# Altium project NUC980开发板.PrjPcb
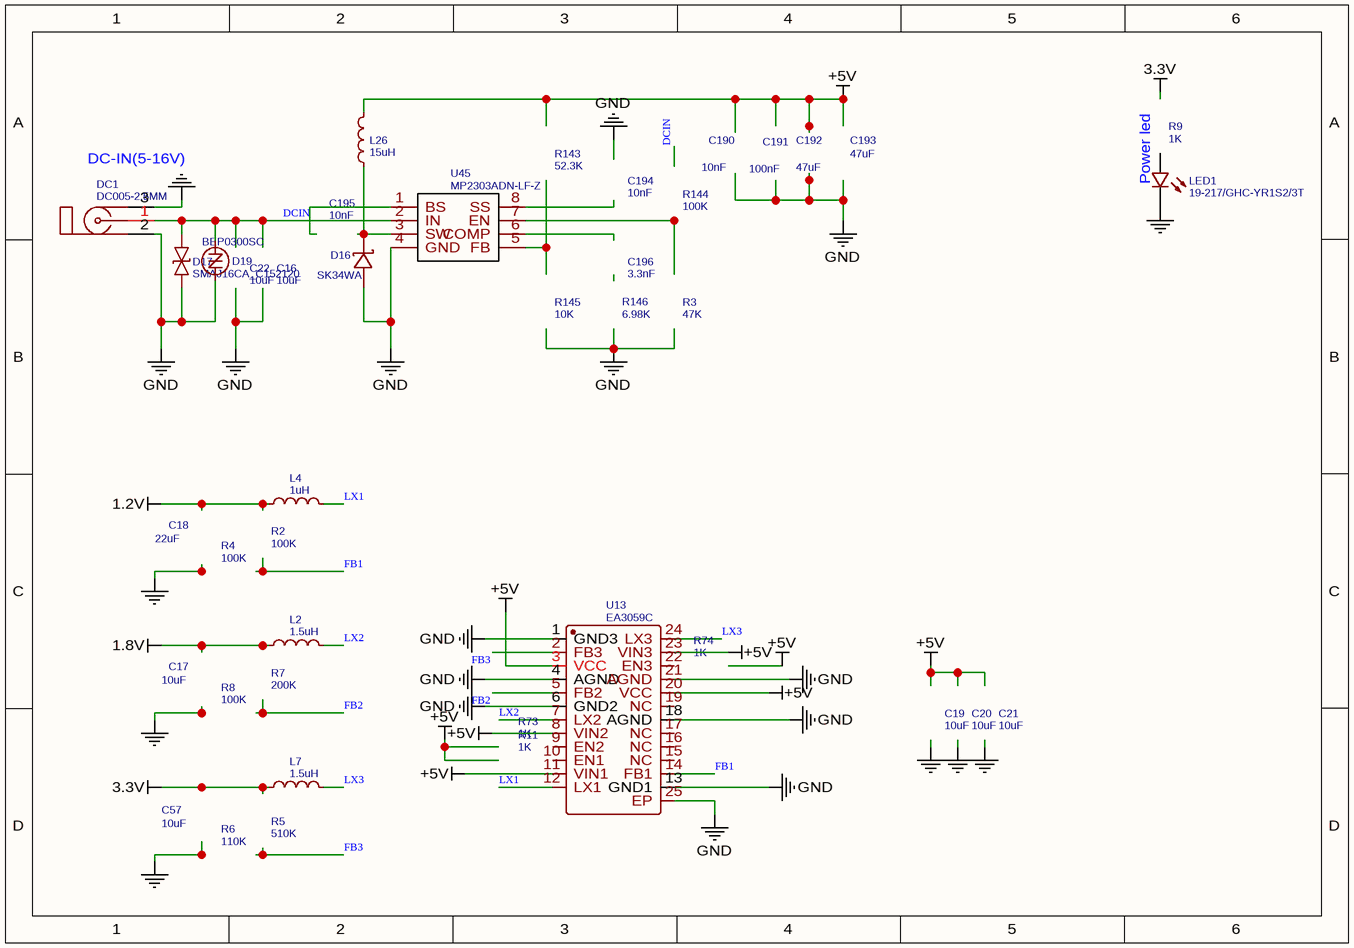
[diagram p0: 电源单元.schdoc]
4 sheets, 128 parts. Net scope: global (net labels, ports and power ports of the same name join across sheets).
Board file: 矩形板V6.0(可制造).pcbdoc
Sheets:
  电源单元.schdoc
  主控单元.schdoc
  接口单元.schdoc
  存储单元.schdoc

## Sheet 电源单元.schdoc
size 252 x 176 mm

### Parts
C16  10uF  [1206]
C17  10uF  [0603]
C18  22uF  [0603]
C19  10uF  [0603]
C20  10uF  [0603]
C21  10uF  [0603]
C22  10uF  [1206]
C57  10uF  [0603]
C190  10nF  [0603]
C191  100nF  [0603]
C192  47uF  [1210]
C193  47uF  [1210]
C194  10nF  [0603]
C195  10nF  [0603]
C196  3.3nF  [0603]
D16  SK34WA  [SOD-123F]
D17  SMAJ16CA_C152120  [SMA(DO-214AC)-DOB]
D19  BEP0300SC  [SMB(DO-214AA)]
DC1  DC005-2.5MM  [DC-5020]
L2  1.5uH  [L-SMD-4.1X4.6]
L4  1uH  [L-SMD-4.1X4.6]
L7  1.5uH  [L-SMD-4.1X4.6]
L26  15uH  [SMD-L-7.1X6.6]
LED1  19-217/GHC-YR1S2/3T  [LED-0603]
R2  100K  [0603]
R3  47K  [0603]
R4  100K  [0603]
R5  510K  [0603]
R6  110K  [0603]
R7  200K  [0603]
R8  100K  [0603]
R9  1K  [0603]
R11  1K  [0603]
R73  1K  [0603]
R74  1K  [0603]
R143  52.3K  [0603]
R144  100K  [0603]
R145  10K  [0603]
R146  6.98K  [0603]
U13  EA3059C  [QFN-24_4X4X05P]
U45  MP2303ADN-LF-Z  [SOIC-8_EP_150MIL]

### Nets
1.2V: L4.1
1.8V: L2.1
3.3V: L7.1
+5V: L26.2 U13.3(VCC) U13.8(VIN2) U13.11(VIN1) U13.20(VCC) U13.23(VIN3)
GND: D16.1(A) D17.1(K) D19.1 DC1.2 DC1.3 LED1.2(C) U13.1(GND3) U13.4(AGND) U13.6(GND2) U13.13(GND1) U13.18(AGND) U13.21(AGND) U13.25(EP) U45.4(GND)
DCIN: D17.2(A) D19.2 DC1.1(VCC) U45.2(IN)
FB1: U13.14(FB1)
FB2: U13.5(FB2)
FB3: U13.2(FB3)
LX1: L4.2 U13.12(LX1)
LX2: L2.2 U13.7(LX2)
LX3: L7.2 U13.24(LX3)
NetD16_2: D16.2(K) L26.1 U45.3(SW)

Not connected (* = marked no-connect by the designer): LED1 1(A); U13 9(EN2) 10(EN1) 15(NC) 16(NC) 17(NC) 19(NC) 22(EN3); U45 1(BS) 5(FB) 6(COMP) 7(EN) 8(SS)

### Notes on the sheet
- (near DC1) DC-IN(5-16V)
- Power led

### Library data of the parts
C16 C22 = 10uF: BOM_Manufacturer Part: CL31A106KBHNNNE; BOM_Manufacturer: SAMSUNG; nameAlias: Capacitance; SMT Type: Basic; BOM_Supplier: LCSC; BOM_LCSC Assembly: Yes; BOM_Supplier Part: C13585; spicePre: C; spiceSymbolName: CL31A106KBHNNNE
C17 C19-C21 C57 = 10uF: BOM_Manufacturer: SAMSUNG; BOM_Manufacturer Part: CL10A106KP8NNNC; nameAlias: Capacitance; BOM_Supplier: LCSC; BOM_LCSC Assembly: Yes; BOM_Supplier Part: C19702; spicePre: C; spiceSymbolName: CL10A106KP8NNNC
C18 = 22uF: BOM_Manufacturer: SAMSUNG; BOM_Manufacturer Part: CL10A226MQ8NRNC; nameAlias: Capacitance; BOM_Supplier: LCSC; BOM_LCSC Assembly: Yes; BOM_Supplier Part: C59461; spicePre: C; spiceSymbolName: CL10A226MQ8NRNC
C190 C194 C195 = 10nF: BOM_Manufacturer: FH; BOM_Manufacturer Part: 0603B103K500NT; nameAlias: Capacitance; SMT Type: Basic; BOM_Supplier: LCSC; BOM_LCSC Assembly: Yes; BOM_Supplier Part: C57112; spicePre: C; spiceSymbolName: 0603B103K500NT
C191 = 100nF: BOM_Manufacturer: YAGEO; BOM_Manufacturer Part: CC0603KRX7R9BB104; nameAlias: Capacitance; SMT Type: Basic; BOM_Supplier: LCSC; BOM_LCSC Assembly: Yes; BOM_Supplier Part: C14663; spicePre: C; spiceSymbolName: CC0603KRX7R9BB104
C192 C193 = 47uF: BOM_Manufacturer: Murata Electronics; BOM_Manufacturer Part: GRM32EC81C476KE15L; nameAlias: Capacitance; Contributor: LCSC; BOM_Supplier: LCSC; BOM_Supplier Part: C162512; spicePre: C; spiceSymbolName: GRM32EC81C476KE15L
C196 = 3.3nF: BOM_Manufacturer Part: CL10B332KB8NNNC; BOM_Manufacturer: SAMSUNG; nameAlias: Capacitance; SMT Type: Basic; BOM_Supplier: LCSC; BOM_LCSC Assembly: Yes; BOM_Supplier Part: C1613; spicePre: C; spiceSymbolName: CL10B332KB8NNNC
D16 = SK34WA: BOM_Manufacturer: SK; SMT Type: Extend; BOM_Supplier: LCSC; BOM_Manufacturer Part: SK34WA; BOM_Supplier Part: C122863; BOM_LCSC Assembly: Yes; spicePre: D
D17 = SMAJ16CA_C152120: BOM_Manufacturer: Bourne Semicon (Shenzhen); Contributor: LCSC; SMT Type: Extend; BOM_Supplier: LCSC; BOM_Supplier Part: C152120; BOM_Manufacturer Part: SMAJ16CA; BOM_LCSC Assembly: Yes; spicePre: D
D19 = BEP0300SC: BOM_Manufacturer: Bourne Semicon (Shenzhen); Contributor: LCSC; SMT Type: Extend; BOM_Supplier: LCSC; BOM_Supplier Part: C152140; BOM_Manufacturer Part: BEP0300SC; BOM_LCSC Assembly: Yes; spicePre: D
DC1 = DC005-2.5MM: BOM_Manufacturer: SOFNG; BOM_Supplier: LCSC; BOM_Manufacturer Part: DC005-2.5MM; BOM_Supplier Part: C111573; spicePre: D
L2 L7 = 1.5uH: BOM_Manufacturer: Chilisin Elec; BOM_Manufacturer Part: MHCI04020-1R5M-R8; nameAlias: Inductance; Contributor: LCSC; BOM_Supplier: LCSC; BOM_Supplier Part: C285743; spicePre: L; spiceSymbolName: MHCI04020-1R5M-R8
L4 = 1uH: BOM_Manufacturer: Chilisin Elec; BOM_Manufacturer Part: MHCI04012-1R0M-R8; nameAlias: Inductance; Contributor: LCSC; BOM_Supplier: LCSC; BOM_Supplier Part: C285749; spicePre: L; spiceSymbolName: MHCI04012-1R0M-R8
L26 = 15uH: BOM_Manufacturer: Sunlord; BOM_Manufacturer Part: MWSA0603-150MT; nameAlias: Inductance; Contributor: LCSC; BOM_Supplier: LCSC; BOM_Supplier Part: C132136; spicePre: L; spiceSymbolName: MWSA0603-150MT
LED1 = 19-217/GHC-YR1S2/3T: BOM_Manufacturer: EVERLIGHT; SMT Type: Basic; BOM_Supplier: LCSC; BOM_Manufacturer Part: 19-217/GHC-YR1S2/3T; BOM_LCSC Assembly: Yes; image: //image.lceda.cn/szlcsc/C72043.jpg; BOM_Supplier Part: C72043; spicePre: L
R2 R4 R8 R144 = 100K: BOM_Manufacturer: UniOhm; BOM_Manufacturer Part: 0603WAF1003T5E; nameAlias: Resistance (Ohms); SMT Type: Basic; BOM_Supplier: LCSC; BOM_LCSC Assembly: Yes; BOM_Supplier Part: C25803; spicePre: R; spiceSymbolName: 0603WAF1003T5E
R3 = 47K: BOM_Manufacturer: UniOhm; BOM_Manufacturer Part: 0603WAF4702T5E; nameAlias: Resistance (Ohms); SMT Type: Basic; BOM_Supplier: LCSC; BOM_LCSC Assembly: Yes; BOM_Supplier Part: C25819; spicePre: R; spiceSymbolName: 0603WAF4702T5E
R5 = 510K: BOM_Manufacturer: UniOhm; BOM_Manufacturer Part: 0603WAF5103T5E; nameAlias: Resistance (Ohms); SMT Type: Basic; BOM_Supplier: LCSC; BOM_LCSC Assembly: Yes; BOM_Supplier Part: C23192; spicePre: R; spiceSymbolName: 0603WAF5103T5E
R6 = 110K: BOM_Manufacturer: UniOhm; BOM_Manufacturer Part: 0603WAF1103T5E; nameAlias: Resistance (Ohms); SMT Type: Basic; BOM_Supplier: LCSC; BOM_LCSC Assembly: Yes; BOM_Supplier Part: C25805; spicePre: R; spiceSymbolName: 0603WAF1103T5E
R7 = 200K: BOM_Manufacturer: UniOhm; BOM_Manufacturer Part: 0603WAF2003T5E; nameAlias: Resistance (Ohms); SMT Type: Basic; BOM_Supplier: LCSC; BOM_LCSC Assembly: Yes; BOM_Supplier Part: C25811; spicePre: R; spiceSymbolName: 0603WAF2003T5E
R9 R11 R73 R74 = 1K: BOM_Manufacturer: UniOhm; BOM_Manufacturer Part: 0603WAF1001T5E; nameAlias: Resistance (Ohms); SMT Type: Basic; BOM_Supplier: LCSC; BOM_LCSC Assembly: Yes; BOM_Supplier Part: C21190; spicePre: R; spiceSymbolName: 0603WAF1001T5E
R143 = 52.3K: BOM_Manufacturer: UniOhm; BOM_Manufacturer Part: 0603WAF5232T5E; nameAlias: Resistance (Ohms); SMT Type: Extend; BOM_Supplier: LCSC; BOM_Supplier Part: C23198; BOM_LCSC Assembly: Yes; spicePre: R; spiceSymbolName: 0603WAF5232T5E
R145 = 10K: BOM_Manufacturer: UniOhm; BOM_Manufacturer Part: 0603WAF1002T5E; nameAlias: Resistance (Ohms); SMT Type: Basic; BOM_Supplier: LCSC; BOM_LCSC Assembly: Yes; BOM_Supplier Part: C25804; spicePre: R; spiceSymbolName: 0603WAF1002T5E
R146 = 6.98K: BOM_Manufacturer: UniOhm; BOM_Manufacturer Part: 0603WAF6981T5E; nameAlias: Resistance (Ohms); SMT Type: Extend; BOM_Supplier: LCSC; BOM_Supplier Part: C23215; BOM_LCSC Assembly: Yes; spicePre: R; spiceSymbolName: 0603WAF6981T5E
U13 = EA3059C: BOM_Manufacturer: Everanalog; BOM_Manufacturer Part: EA3059; SMT Type: Extend; Contributor: 13603072355; BOM_Supplier: LCSC; BOM_Supplier Part: C111586x; BOM_LCSC Assembly: Yes; spicePre: U
U45 = MP2303ADN-LF-Z: BOM_Manufacturer: MPS; SMT Type: Basic; BOM_Supplier: LCSC; BOM_Manufacturer Part: MP2303ADN-LF-Z; BOM_LCSC Assembly: Yes; image: //image.lceda.cn/szlcsc/C18876.jpg; BOM_Supplier Part: C18876; spicePre: U

## Sheet 主控单元.schdoc
size 418 x 270 mm
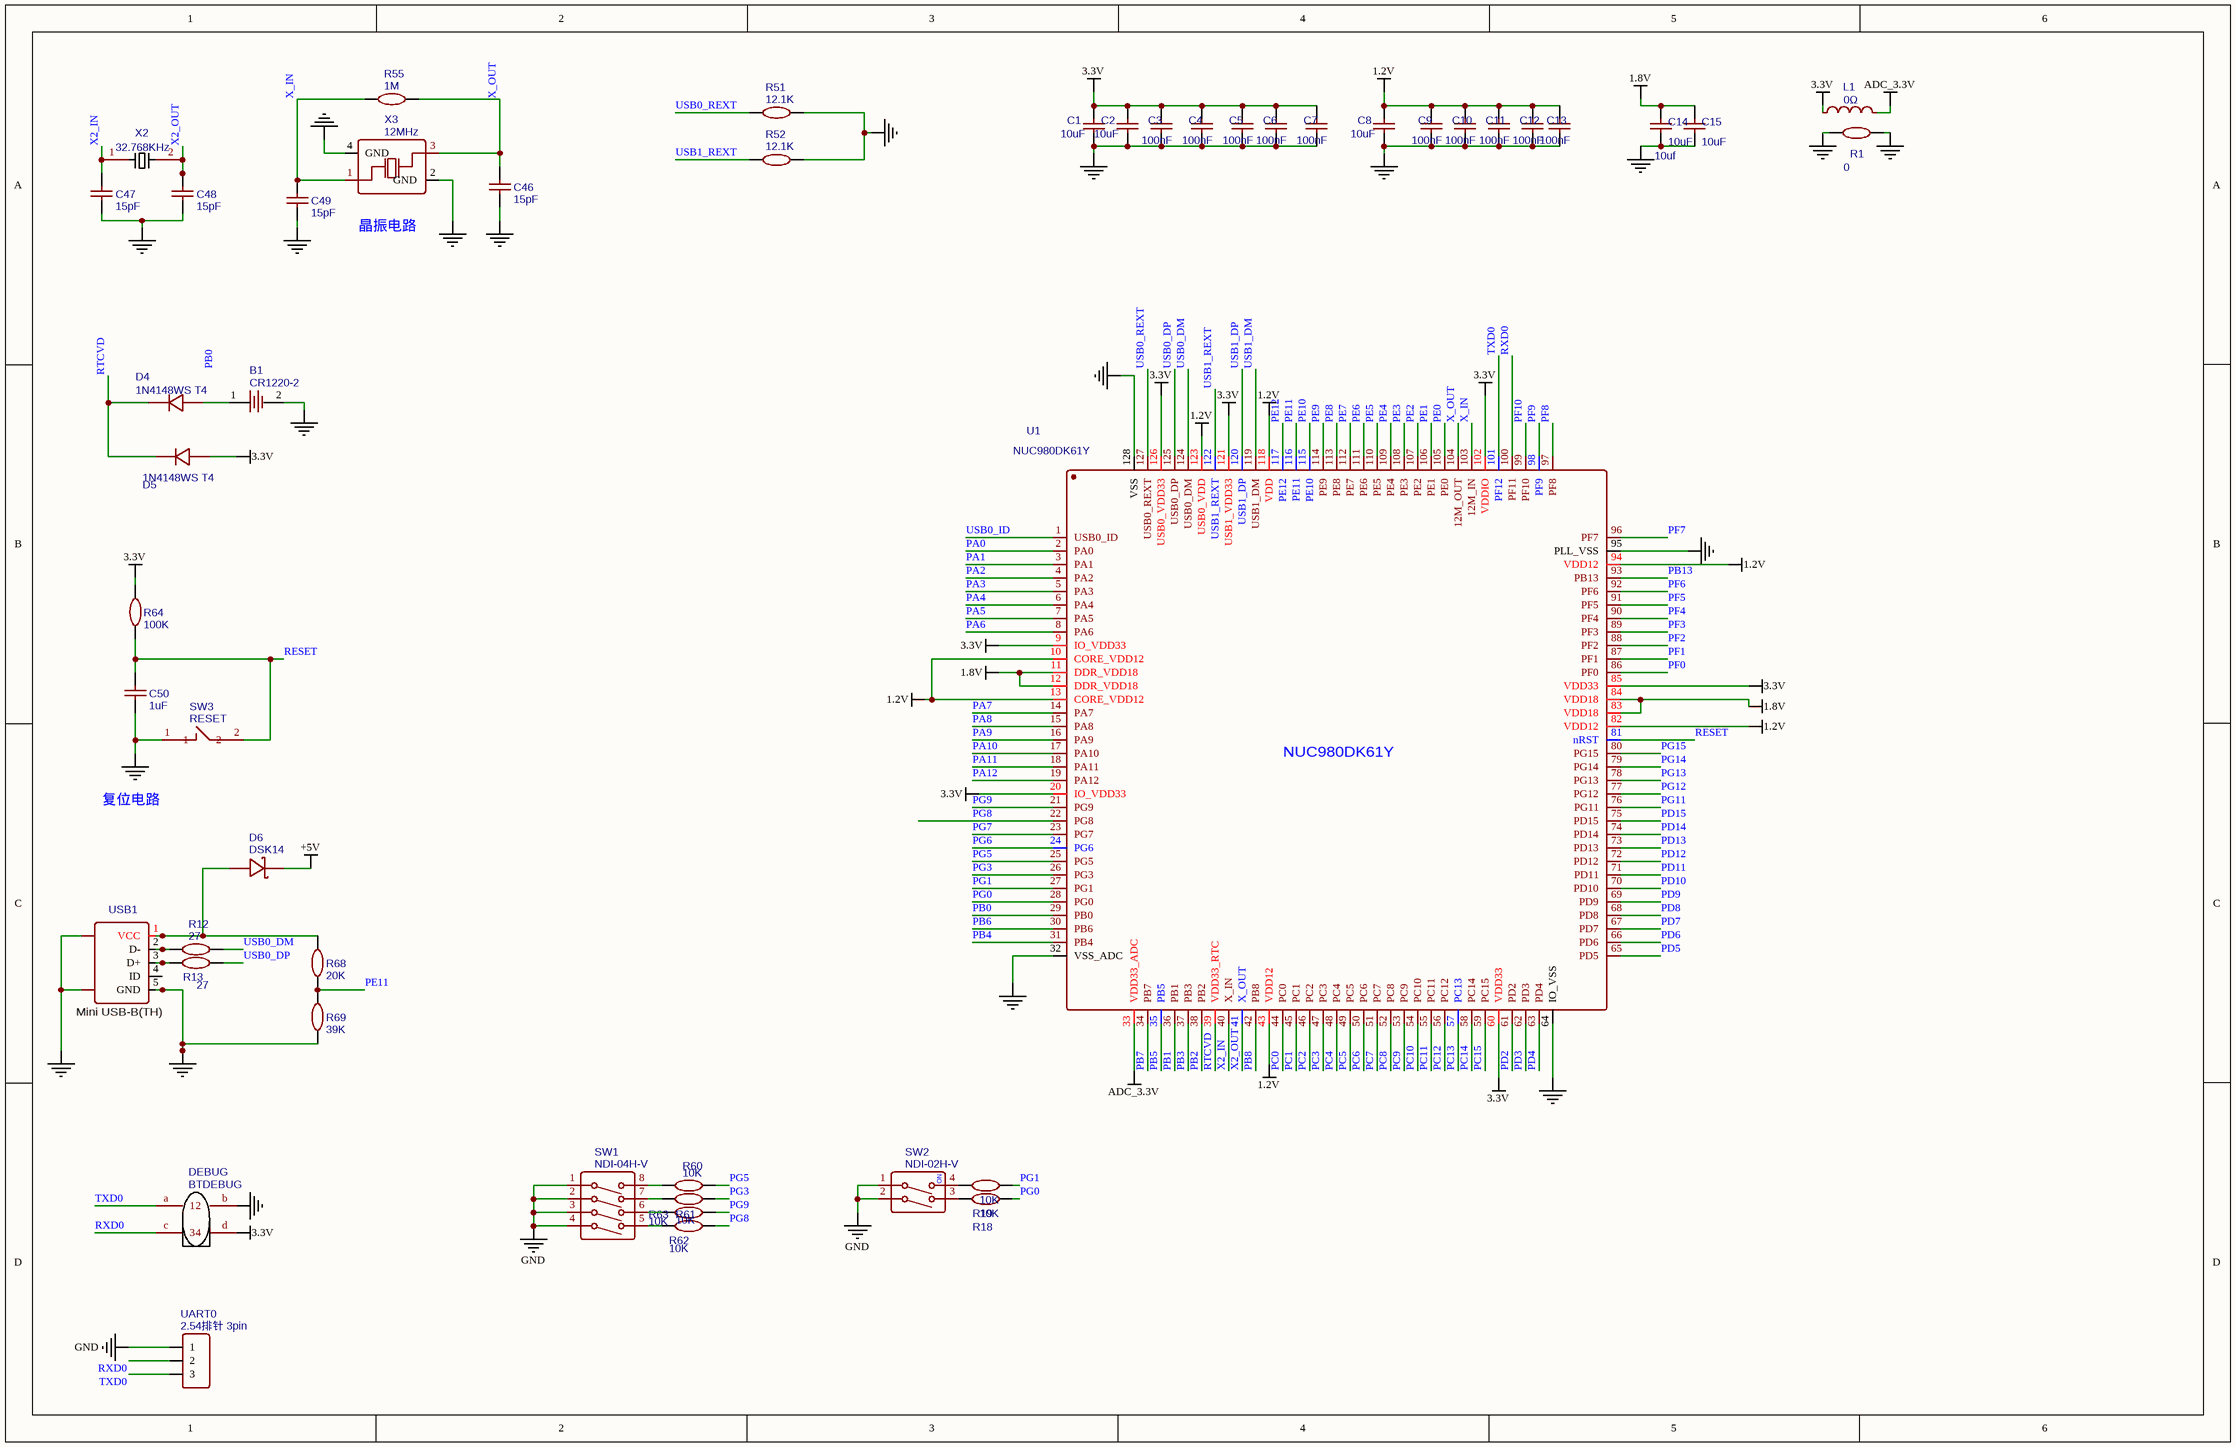
[diagram p1: 主控单元.schdoc]

### Parts
B1  CR1220-2  [BATTERY-2]
C1  10uF  [0805]
C2  10uF  [0805]
C3  100nF  [0402]
C4  100nF  [0402]
C5  100nF  [0402]
C6  100nF  [0402]
C7  100nF  [0402]
C8  10uF  [0805]
C9  100nF  [0402]
C10  100nF  [0402]
C11  100nF  [0402]
C12  100nF  [0402]
C13  100nF  [0402]
C14  10uF  [0805]
C15  10uF  [0805]
C46  15pF  [0402]
C47  15pF  [0402]
C48  15pF  [0402]
C49  15pF  [0402]
C50  1uF  [0603]
D4  1N4148WS T4  [SOD-323]
D5  1N4148WS T4  [SOD-323]
D6  DSK14  [SOD-123]
DEBUG  BTDEBUG  [4PINO]
L1  0Ω  [0603]
R1  0  [0603]
R12  27  [0603]
R13  27  [0603]
R18  10K  [0603]
R19  10K  [0603]
R51  12.1K  [0603]
R52  12.1K  [0603]
R55  1M  [0402]
R60  10K  [0603]
R61  10K  [0603]
R62  10K  [0603]
R63  10K  [0603]
R64  100K  [0603]
R68  20K  [0402]
R69  39K  [0402]
SW1  NDI-04H-V  [NDI-04H-V]
SW2  NDI-02H-V  [NDI-02H-V]
SW3  RESET  [KEY-TOUCH-SMD-6.0*3.5*H-(A)]
U1  NUC980DK61Y  [LQFP-128_14X14X04P]
UART0  2.54排针 3pin  [HDR-3X1/2.54]
USB1  Mini USB-B 5P-Female-TH_C46398  [USB-MINI-2]  (value not drawn)
X2  32.768KHz  [SMD-3215_2P]
X3  12MHz  [OSC-YSX-3225_4P]

### Nets
1.2V: C8.2 C9.2 C10.2 C11.2 C12.2 C13.2 U1.10(CORE_VDD12) U1.13(CORE_VDD12) U1.43(VDD12) U1.82(VDD12) U1.94(VDD12) U1.118(VDD) U1.123(USB0_VDD)
1.8V: C14.2 C15.2 U1.11(DDR_VDD18) U1.12(DDR_VDD18) U1.83(VDD18) U1.84(VDD18)
3.3V: C1.2 C2.2 C3.2 C4.2 C5.2 C6.2 C7.2 D5.1(A) DEBUG.d(4) L1.1 R64.2 U1.9(IO_VDD33) U1.20(IO_VDD33) U1.60(VDD33) U1.85(VDD33) U1.102(VDDIO) U1.121(USB1_VDD33) U1.126(USB0_VDD33)
+5V: D6.2(K)
ADC_3.3V: L1.2 U1.33(VDD33_ADC)
GND: B1.2 C1.1 C2.1 C3.1 C4.1 C5.1 C6.1 C7.1 C8.1 C9.1 C10.1 C11.1 C12.1 C13.1 C14.1 C15.1 C46.1 C47.1 C48.1 C49.1 C50.1 DEBUG.b(2) R1.1 R51.1 R52.1 R69.1 SW1.1 SW1.2 SW1.3 SW1.4 SW2.1 SW2.2 SW3.1 U1.64(IO_VSS) U1.95(PLL_VSS) U1.128(VSS) UART0.1 USB1.0 USB1.5(GND) X3.2(GND) X3.4(GND)
GND1: R1.2 U1.32(VSS_ADC)
PA0: U1.2(PA0)
PA1: U1.3(PA1)
PA2: U1.4(PA2)
PA3: U1.5(PA3)
PA4: U1.6(PA4)
PA5: U1.7(PA5)
PA6: U1.8(PA6)
PA7: U1.14(PA7)
PA8: U1.15(PA8)
PA9: U1.16(PA9)
PA10: U1.17(PA10)
PA11: U1.18(PA11)
PA12: U1.19(PA12)
PB0: U1.29(PB0)
PB1: U1.36(PB1)
PB2: U1.38(PB2)
PB3: U1.37(PB3)
PB4: U1.31(PB4)
PB5: U1.35(PB5)
PB6: U1.30(PB6)
PB7: U1.34(PB7)
PB8: U1.42(PB8)
PB13: U1.93(PB13)
PC0: U1.44(PC0)
PC1: U1.45(PC1)
PC2: U1.46(PC2)
PC3: U1.47(PC3)
PC4: U1.48(PC4)
PC5: U1.49(PC5)
PC6: U1.50(PC6)
PC7: U1.51(PC7)
PC8: U1.52(PC8)
PC9: U1.53(PC9)
PC10: U1.54(PC10)
PC11: U1.55(PC11)
PC12: U1.56(PC12)
PC13: U1.57(PC13)
PC14: U1.58(PC14)
PC15: U1.59(PC15)
PD2: U1.61(PD2)
PD3: U1.62(PD3)
PD4: U1.63(PD4)
PD5: U1.65(PD5)
PD6: U1.66(PD6)
PD7: U1.67(PD7)
PD8: U1.68(PD8)
PD9: U1.69(PD9)
PD10: U1.70(PD10)
PD11: U1.71(PD11)
PD12: U1.72(PD12)
PD13: U1.73(PD13)
PD14: U1.74(PD14)
PD15: U1.75(PD15)
PE0: U1.105(PE0)
PE1: U1.106(PE1)
PE2: U1.107(PE2)
PE3: U1.108(PE3)
PE4: U1.109(PE4)
PE5: U1.110(PE5)
PE6: U1.111(PE6)
PE7: U1.112(PE7)
PE8: U1.113(PE8)
PE9: U1.114(PE9)
PE10: U1.115(PE10)
PE11: R68.1 R69.2 U1.116(PE11)
PE12: U1.117(PE12)
PF0: U1.86(PF0)
PF1: U1.87(PF1)
PF2: U1.88(PF2)
PF3: U1.89(PF3)
PF4: U1.90(PF4)
PF5: U1.91(PF5)
PF6: U1.92(PF6)
PF7: U1.96(PF7)
PF8: U1.97(PF8)
PF9: U1.98(PF9)
PF10: U1.99(PF10)
PG0: R18.1 U1.28(PG0)
PG1: R19.1 U1.27(PG1)
PG3: R61.1 U1.26(PG3)
PG5: R60.1 U1.25(PG5)
PG6: U1.24(PG6)
PG7: U1.23(PG7)
PG8: R62.1 U1.22(PG8)
PG9: R63.1 U1.21(PG9)
PG11: U1.76(PG11)
PG12: U1.77(PG12)
PG13: U1.78(PG13)
PG14: U1.79(PG14)
PG15: U1.80(PG15)
RESET: C50.2 R64.1 SW3.2 U1.81(nRST)
RTCVD: D4.2(K) D5.2(K) U1.39(VDD33_RTC)
RXD0: DEBUG.c(3) U1.100(PF11) UART0.2
TXD0: DEBUG.a(1) U1.101(PF12) UART0.3
USB0_DM: R12.2 U1.124(USB0_DM)
USB0_DP: R13.2 U1.125(USB0_DP)
USB0_ID: U1.1(USB0_ID)
USB0_REXT: R51.2 U1.127(USB0_REXT)
USB1_DM: U1.119(USB1_DM)
USB1_DP: U1.120(USB1_DP)
USB1_REXT: R52.2 U1.122(USB1_REXT)
X2_IN: C47.2 U1.40(X_IN) X2.1
X2_OUT: C48.2 U1.41(X_OUT) X2.2
X_IN: C49.2 R55.1 U1.103(12M_IN) X3.1(OSC1)
X_OUT: C46.2 R55.2 U1.104(12M_OUT) X3.3(OSC2)
NetB1_1: B1.1 D4.1(A)
NetD6_1: D6.1(A) R68.2 USB1.1(VCC)
NetR12_1: R12.1 USB1.2(D-)
NetR13_1: R13.1 USB1.3(D+)
NetR18_2: R18.2 SW2.3
NetR19_2: R19.2 SW2.4
NetR60_2: R60.2 SW1.8
NetR61_2: R61.2 SW1.7
NetR62_2: R62.2 SW1.5
NetR63_2: R63.2 SW1.6

Not connected (* = marked no-connect by the designer): USB1 4(ID)

### Notes on the sheet
- 10uf
- 晶振电路
- 复位电路
- Labels drawn without touching a wire or pin: PB0
- (in symbol Mini USB-B 5P-Female-TH_C46398) Mini USB-B(TH)
- (in symbol NDI-02H-V) ON

### Library data of the parts
B1 = CR1220-2: BOM_Manufacturer: Q&J; BOM_Supplier: LCSC; BOM_Manufacturer Part: CR1220-2; image: //image.lceda.cn/szlcsc/C70381.jpg; BOM_Supplier Part: C70381; spicePre: B
C1 C2 C8 C14 C15 = 10uF: BOM_Manufacturer Part: CL21A106KAYNNNE; BOM_Manufacturer: SAMSUNG; nameAlias: Capacitance; BOM_Supplier: LCSC; BOM_LCSC Assembly: Yes; BOM_Supplier Part: C15850; spicePre: C; spiceSymbolName: CL21A106KAYNNNE
C3-C7 C9-C13 = 100nF: BOM_Manufacturer Part: CL05B104KO5NNNC; BOM_Manufacturer: SAMSUNG; nameAlias: Capacitance; BOM_Supplier: LCSC; BOM_LCSC Assembly: Yes; BOM_Supplier Part: C1525; spicePre: C; spiceSymbolName: CL05B104KO5NNNC
C46-C49 = 15pF: BOM_Manufacturer: FH; BOM_Manufacturer Part: 0402CG150J500NT; nameAlias: Capacitance; BOM_Supplier: LCSC; BOM_LCSC Assembly: Yes; BOM_Supplier Part: C1548; spicePre: C; spiceSymbolName: 0402CG150J500NT
C50 = 1uF: BOM_Manufacturer Part: CL10A105KB8NNNC; BOM_Manufacturer: SAMSUNG; nameAlias: Capacitance; SMT Type: Basic; BOM_Supplier: LCSC; BOM_LCSC Assembly: Yes; BOM_Supplier Part: C15849; spicePre: C; spiceSymbolName: CL10A105KB8NNNC
D4 D5 = 1N4148WS T4: BOM_Manufacturer: CJ; BOM_Supplier: LCSC; BOM_Manufacturer Part: 1N4148WS T4; BOM_LCSC Assembly: Yes; image: //image.lceda.cn/szlcsc/C2128.jpg; BOM_Supplier Part: C2128; spicePre: D
D6 = DSK14: BOM_Manufacturer: MDD; SMT Type: Extend; BOM_Supplier: LCSC; BOM_Manufacturer Part: DSK14; image: //image.lceda.cn/szlcsc/C37049.jpg; BOM_Supplier Part: C37049; BOM_LCSC Assembly: Yes; spicePre: D
DEBUG = BTDEBUG: Contributor: wode320; sourceId: oYS93lDVP; timeStamp: 1450252921; BOM_Manufacturer Part: ?; spicePre: U
L1 = 0Ω: BOM_Manufacturer: FH; BOM_Manufacturer Part: CBG160808U000T; nameAlias: Value; SMT Type: Extend; BOM_Supplier: LCSC; BOM_Supplier Part: C43163; BOM_LCSC Assembly: Yes; spicePre: L; spiceSymbolName: CBG160808U000T
R1 = 0: BOM_Manufacturer: UniOhm; BOM_Manufacturer Part: 0603WAF0000T5E; nameAlias: Resistance (Ohms); SMT Type: Basic; BOM_Supplier: LCSC; BOM_LCSC Assembly: Yes; BOM_Supplier Part: C21189; spicePre: R; spiceSymbolName: 0603WAF0000T5E
R12 R13 = 27: BOM_Manufacturer: UniOhm; BOM_Manufacturer Part: 0603WAF270JT5E; nameAlias: Resistance (Ohms); SMT Type: Basic; BOM_Supplier: LCSC; BOM_LCSC Assembly: Yes; BOM_Supplier Part: C25190; spicePre: R; spiceSymbolName: 0603WAF270JT5E
R18 R19 R60-R63 = 10K: BOM_Manufacturer: UniOhm; BOM_Manufacturer Part: 0603WAF1002T5E; nameAlias: Resistance (Ohms); BOM_Supplier: LCSC; BOM_LCSC Assembly: Yes; BOM_Supplier Part: C25804; spicePre: R; spiceSymbolName: 0603WAF1002T5E
R51 R52 = 12.1K: BOM_Manufacturer: UniOhm; BOM_Manufacturer Part: 0603WAF1212T5E; nameAlias: Resistance (Ohms); SMT Type: Extend; BOM_Supplier: LCSC; BOM_Supplier Part: C22864; BOM_LCSC Assembly: Yes; spicePre: R; spiceSymbolName: 0603WAF1212T5E
R55 = 1M: BOM_Manufacturer: UniOhm; BOM_Manufacturer Part: 0402WGF1004TCE; nameAlias: Resistance (Ohms); BOM_Supplier: LCSC; BOM_LCSC Assembly: Yes; BOM_Supplier Part: C26083; spicePre: R; spiceSymbolName: 0402WGF1004TCE
R64 = 100K: as R2 on sheet 电源单元; BOM_Supplier: LCSC; BOM_LCSC Assembly: Yes; BOM_Supplier Part: C25803; spicePre: R; spiceSymbolName: 0603WAF1003T5E
R68 = 20K: BOM_Manufacturer: UniOhm; BOM_Manufacturer Part: 0402WGF2002TCE; nameAlias: Resistance (Ohms); BOM_Supplier: LCSC; BOM_LCSC Assembly: Yes; BOM_Supplier Part: C25765; spicePre: R; spiceSymbolName: 0402WGF2002TCE
R69 = 39K: BOM_Manufacturer: UniOhm; BOM_Manufacturer Part: 0402WGF3902TCE; nameAlias: Resistance (Ohms); BOM_Supplier: LCSC; BOM_LCSC Assembly: Yes; BOM_Supplier Part: C25783; spicePre: R; spiceSymbolName: 0402WGF3902TCE
SW1 = NDI-04H-V: BOM_Manufacturer: Diptronics; Contributor: LCSC; BOM_Supplier: LCSC; BOM_Supplier Part: C225000; BOM_Manufacturer Part: NDI-04H-V; spicePre: S
SW2 = NDI-02H-V: BOM_Manufacturer: Diptronics; Contributor: LCSC; BOM_Supplier: LCSC; BOM_Supplier Part: C224999; BOM_Manufacturer Part: NDI-02H-V; spicePre: S
SW3 = RESET: BOM_Manufacturer: HYP; BOM_Manufacturer Part: 1TS002B-1900-4300; Contributor: LCSC; BOM_Supplier: LCSC; BOM_Supplier Part: C318823; spicePre: S
U1 = NUC980DK61Y: Contributor: 13603072355; BOM_Manufacturer Part: ?; spicePre: U
UART0 = 2.54排针 3pin: BOM_Manufacturer: BOOMELE; BOM_Manufacturer Part: Header2.54mm 1*3P; Contributor: yds432427; BOM_Supplier: LCSC; image: //image.lceda.cn/szlcsc/C49257.jpg; BOM_Supplier Part: C49257; spicePre: P
USB1 = Mini USB-B 5P-Female-TH_C46398: BOM_Manufacturer: ValuePro; BOM_Manufacturer Part: MINI 5PFemale90Degree plate four feet copper shell LCPVinyl; BOM_Supplier: LCSC; image: //image.lceda.cn/szlcsc/C46398.jpg; BOM_Supplier Part: C46398; spicePre: U
X2 = 32.768KHz: BOM_Manufacturer Part: Q13FC1350000400; BOM_Manufacturer: EPSON; nameAlias: Frequency; BOM_Supplier: LCSC; BOM_LCSC Assembly: Yes; BOM_Supplier Part: C32346; spicePre: X; spiceSymbolName: Q13FC1350000400
X3 = 12MHz: BOM_Manufacturer: YXC; BOM_Manufacturer Part: X322512MSB4SI; nameAlias: Frequency; BOM_Supplier: LCSC; BOM_LCSC Assembly: Yes; BOM_Supplier Part: C9002; spicePre: X; spiceSymbolName: X322512MSB4SI

## Sheet 接口单元.schdoc
size 447 x 194 mm
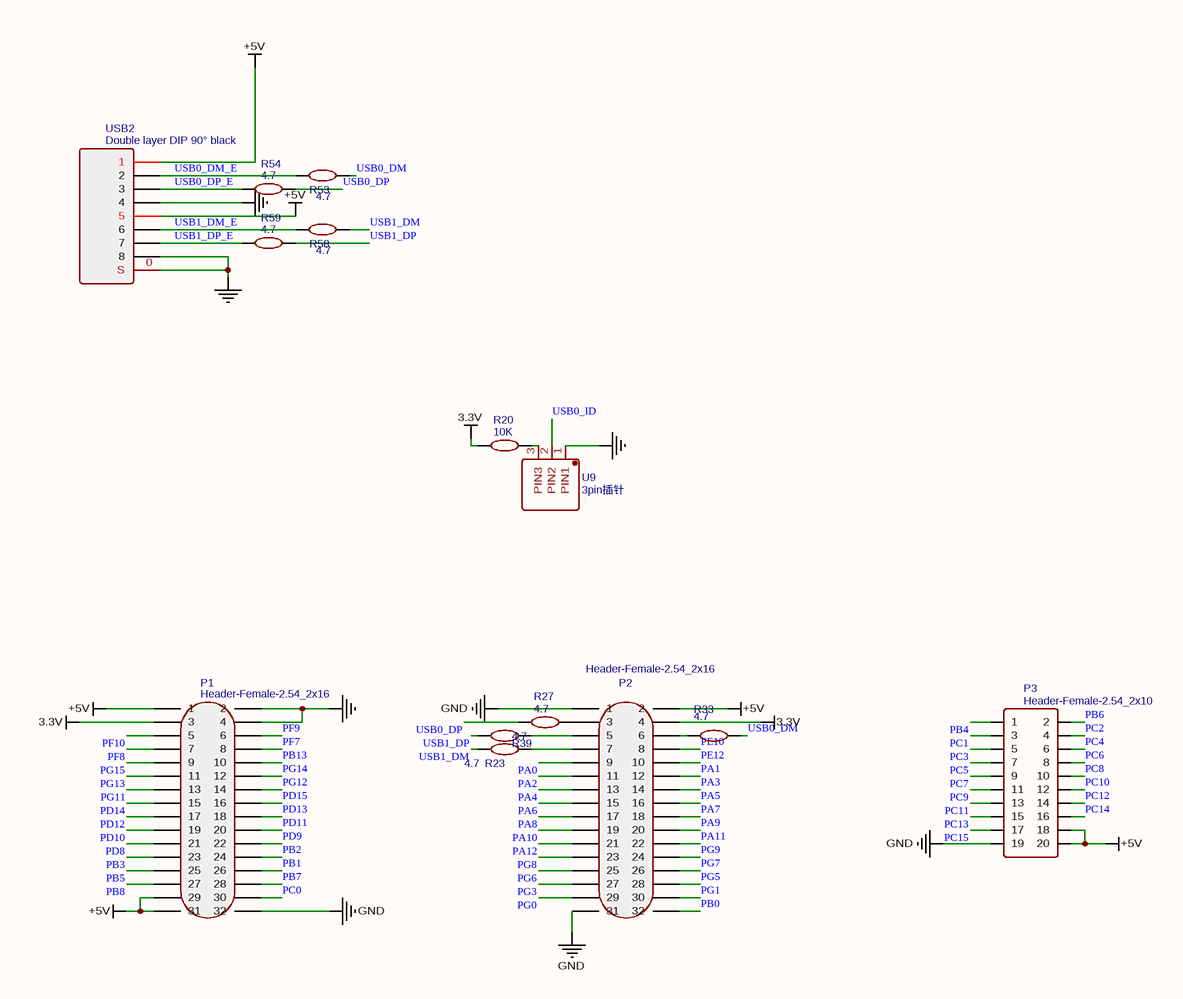
[diagram p2: 接口单元.schdoc]

### Parts
P1  Header-Female-2.54_2x16  [HDR-16X2/2.54]
P2  Header-Female-2.54_2x16  [HDR-16X2/2.54]
P3  Header-Female-2.54_2x10  [HDR-10X2/2.54]
R20  10K  [0603]
R23  4.7  [0603]
R27  4.7  [0603]
R33  4.7  [0603]
R39  4.7  [0603]
R53  4.7  [0603]
R54  4.7  [0603]
R58  4.7  [0603]
R59  4.7  [0603]
U9  3pin插针  [HDR-3X1/2.54]
USB2  Double layer DIP 90° black  [USB-M-51]

### Nets
3.3V: P1.3 P2.4 R20.2
+5V: P1.1 P1.29 P1.31 P2.2 P3.18 P3.20 USB2.1 USB2.5
GND: P1.2 P1.4 P1.32 P2.1 P2.31 P3.19 U9.1(PIN1) USB2.0(S) USB2.4 USB2.8
PA0: P2.9
PA1: P2.12
PA2: P2.11
PA3: P2.14
PA4: P2.13
PA5: P2.16
PA6: P2.15
PA7: P2.18
PA8: P2.17
PA9: P2.20
PA10: P2.19
PA11: P2.22
PA12: P2.21
PB0: P2.32
PB1: P1.26
PB2: P1.24
PB3: P1.23
PB4: P3.1
PB5: P1.25
PB6: P3.2
PB7: P1.28
PB8: P1.27
PB13: P1.10
PC0: P1.30
PC1: P3.3
PC2: P3.4
PC3: P3.5
PC4: P3.6
PC5: P3.7
PC6: P3.8
PC7: P3.9
PC8: P3.10
PC9: P3.11
PC10: P3.12
PC11: P3.13
PC12: P3.14
PC13: P3.15
PC14: P3.16
PC15: P3.17
PD8: P1.21
PD9: P1.22
PD10: P1.19
PD11: P1.20
PD12: P1.17
PD13: P1.18
PD14: P1.15
PD15: P1.16
PE10: P2.8
PE12: P2.10
PF7: P1.8
PF8: P1.7
PF9: P1.6
PF10: P1.5
PG0: P2.29
PG1: P2.30
PG3: P2.27
PG5: P2.28
PG6: P2.25
PG7: P2.26
PG8: P2.23
PG9: P2.24
PG11: P1.13
PG12: P1.14
PG13: P1.11
PG14: P1.12
PG15: P1.9
USB0_DM: R33.2 R53.2
USB0_DM_E: R53.1 USB2.2
USB0_DP: R27.2 R54.2
USB0_DP_E: R54.1 USB2.3
USB0_ID: U9.2(PIN2)
USB1_DM: R39.1 R58.2
USB1_DM_E: R58.1 USB2.6
USB1_DP: R23.1 R59.2
USB1_DP_E: R59.1 USB2.7
NetP2_3: P2.3 R27.1
NetP2_5: P2.5 R23.2
NetP2_6: P2.6 R33.1
NetP2_7: P2.7 R39.2
NetR20_1: R20.1 U9.3(PIN3)

### Library data of the parts
P1 P2 = Header-Female-2.54_2x16: BOM_Manufacturer: EasyEDA; BOM_EasyEDA: E55795; BOM_Supplier Part: E55795; BOM_Supplier: EasyEDA; BOM_Manufacturer Part: Header-Female-2.54_2x16; spicePre: P
P3 = Header-Female-2.54_2x10: BOM_Manufacturer: BOOMELE; BOM_Manufacturer Part: 2.54mm,2×10Double row female; BOM_Supplier: LCSC; image: //image.lceda.cn/szlcsc/C30867.jpg; BOM_Supplier Part: C30867; spicePre: P
R20 = 10K: as R18 on sheet 主控单元; BOM_Supplier: LCSC; BOM_LCSC Assembly: Yes; BOM_Supplier Part: C25804; spicePre: R; spiceSymbolName: 0603WAF1002T5E
R23 R27 R33 R39 R53 R54 R58 R59 = 4.7: BOM_Manufacturer: UniOhm; BOM_Manufacturer Part: 0603WAF470KT5E; nameAlias: Resistance (Ohms); BOM_Supplier: LCSC; BOM_Supplier Part: C23164; BOM_LCSC Assembly: Yes; spicePre: R; spiceSymbolName: 0402WGF470KTCE
U9 = 3pin插针: Contributor: DesignMyself; BOM_Manufacturer Part: 3pin插针; spicePre: U
USB2 = Double layer DIP 90° black: BOM_Manufacturer: ValuePro; BOM_Supplier: LCSC; BOM_Manufacturer Part: Double layer DIP 90° black; image: //image.lceda.cn/szlcsc/C12049.jpg; BOM_Supplier Part: C12049; spicePre: U

## Sheet 存储单元.schdoc
size 292 x 196 mm
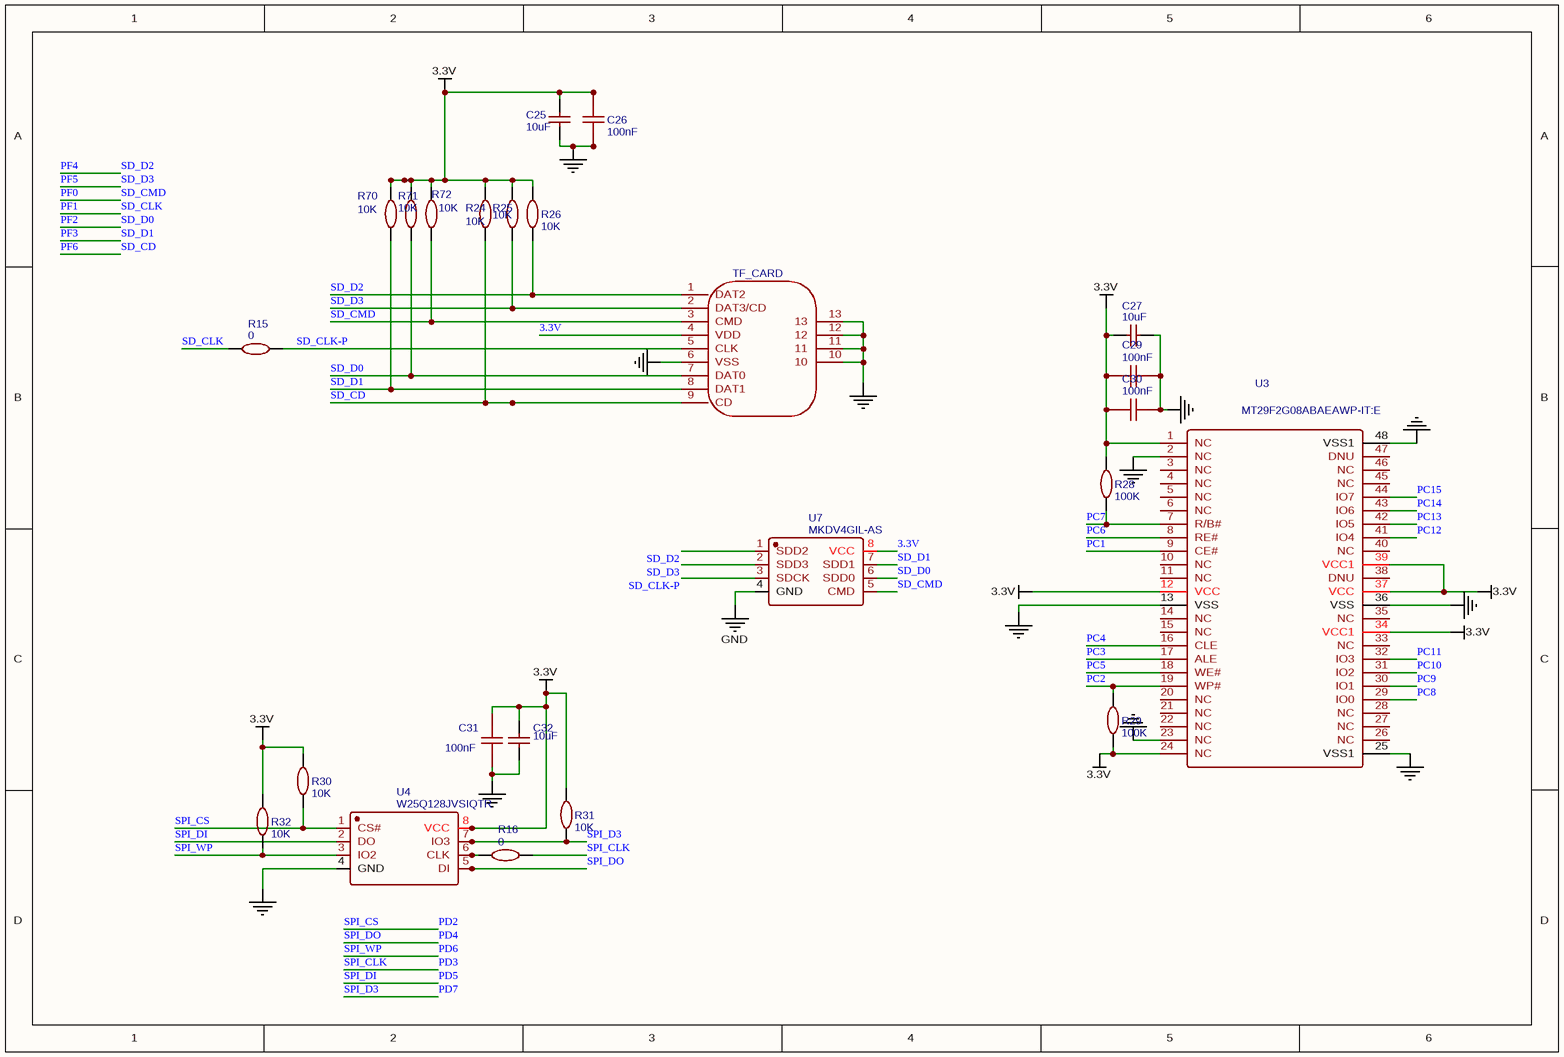
[diagram p3: 存储单元.schdoc]

### Parts
C25  10uF  [0805]
C26  100nF  [0603]
C27  10uF  [0805]
C29  100nF  [0603]
C30  100nF  [0603]
C31  100nF  [0603]
C32  10uF  [0805]
R15  0  [0603]
R16  0  [0603]
R24  10K  [0603]
R25  10K  [0603]
R26  10K  [0603]
R28  100K  [0603]
R29  100K  [0603]
R30  10K  [0603]
R31  10K  [0603]
R32  10K  [0603]
R70  10K  [0603]
R71  10K  [0603]
R72  10K  [0603]
TF_CARD1  TF_CARD  [TF-115_MRS]
U3  MT29F2G08ABAEAWP-IT:E  [TSOP-48]
U4  W25Q128JVSIQTR  [SOIC-8_208MIL]
U7  MKDV4GIL-AS  [LGA-8_8PIN-L6.10-W8.10-PITCH0.65-TL]

### Nets
3.3V: C25.2 C26.2 C27.2 C29.1 C30.2 C31.1 C32.1 R24.2 R25.2 R26.2 R28.2 R29.1 R30.2 R31.2 R32.2 R70.2 R71.2 R72.2 TF_CARD1.4(VDD) U3.1(NC) U3.12(VCC) U3.24(NC) U3.34(VCC1) U3.37(VCC) U3.39(VCC1) U4.8(VCC) U7.8(VCC)
GND: C25.1 C26.1 C27.1 C29.2 C30.1 C31.2 C32.2 TF_CARD1.6(VSS) TF_CARD1.10 TF_CARD1.11 TF_CARD1.12 TF_CARD1.13 U3.2(NC) U3.13(VSS) U3.23(NC) U3.25(VSS1) U3.36(VSS) U3.48(VSS1) U4.4(GND) U7.4(GND)
PC1: U3.9(CE#)
PC2: R29.2 U3.19(WP#)
PC3: U3.17(ALE)
PC4: U3.16(CLE)
PC5: U3.18(WE#)
PC6: U3.8(RE#)
PC7: R28.1 U3.7(R/B#)
PC8: U3.29(IO0)
PC9: U3.30(IO1)
PC10: U3.31(IO2)
PC11: U3.32(IO3)
PC12: U3.41(IO4)
PC13: U3.42(IO5)
PC14: U3.43(IO6)
PC15: U3.44(IO7)
PD2: R30.1 U4.1(CS#)  [also labelled SPI_CS]
PD3: R16.2  [also labelled SPI_CLK]
PD4: U4.5(DI)  [also labelled SPI_DO]
PD5: U4.2(DO)  [also labelled SPI_DI]
PD6: R32.1 U4.3(IO2)  [also labelled SPI_WP]
PD7: R31.1 U4.7(IO3)  [also labelled SPI_D3]
PF0: R72.1 TF_CARD1.3(CMD) U7.5(CMD)  [also labelled SD_CMD]
PF1: R15.1  [also labelled SD_CLK]
PF2: R71.1 TF_CARD1.7(DAT0) U7.6(SDD0)  [also labelled SD_D0]
PF3: R70.1 TF_CARD1.8(DAT1) U7.7(SDD1)  [also labelled SD_D1]
PF4: R26.1 TF_CARD1.1(DAT2) U7.1(SDD2)  [also labelled SD_D2]
PF5: R25.1 TF_CARD1.2(DAT3/CD) U7.2(SDD3)  [also labelled SD_D3]
PF6: R24.1 TF_CARD1.9(CD)  [also labelled SD_CD]
SD_CLK-P: R15.2 TF_CARD1.5(CLK) U7.3(SDCK)
NetR16_1: R16.1 U4.6(CLK)

Not connected (* = marked no-connect by the designer): U3 3(NC) 4(NC) 5(NC) 6(NC) 10(NC) 11(NC) 14(NC) 15(NC) 20(NC) 21(NC) 22(NC) 26(NC) 27(NC) 28(NC) 33(NC) 35(NC) 38(DNU) 40(NC) 45(NC) 46(NC) 47(DNU)

### Library data of the parts
C25 C27 C32 = 10uF: as C1 on sheet 主控单元; BOM_Supplier: LCSC; BOM_LCSC Assembly: Yes; BOM_Supplier Part: C15850; spicePre: C; spiceSymbolName: CL21A106KAYNNNE
C26 C29-C31 = 100nF: as C191 on sheet 电源单元; BOM_Supplier: LCSC; BOM_LCSC Assembly: Yes; BOM_Supplier Part: C14663; spicePre: C; spiceSymbolName: CC0603KRX7R9BB104
R15 R16 = 0: as R1 on sheet 主控单元; BOM_Supplier: LCSC; BOM_LCSC Assembly: Yes; BOM_Supplier Part: C21189; spicePre: R; spiceSymbolName: 0603WAF0000T5E
R24-R26 R70-R72 = 10K: as R18 on sheet 主控单元; BOM_Supplier: LCSC; BOM_LCSC Assembly: Yes; BOM_Supplier Part: C25804; spicePre: R; spiceSymbolName: 0603WAF1002T5E
R28 R29 = 100K: as R2 on sheet 电源单元; BOM_Supplier: LCSC; BOM_LCSC Assembly: Yes; BOM_Supplier Part: C25803; spicePre: R; spiceSymbolName: 0603WAF1003T5E
R30-R32 = 10K: as R145 on sheet 电源单元; BOM_Supplier: LCSC; BOM_LCSC Assembly: Yes; BOM_Supplier Part: C25804; spicePre: R; spiceSymbolName: 0603WAF1002T5E
TF_CARD1 = TF_CARD: Contributor: ration; BOM_Manufacturer Part: ?; BOM_Supplier Part: undefined; spicePre: H
U3 = MT29F2G08ABAEAWP-IT:E: BOM_Manufacturer: Micron; Contributor: LCSC; SMT Type: Extend; BOM_Supplier: LCSC; BOM_Manufacturer Part: MT29F2G08ABAEAWP-IT:E; BOM_Supplier Part: C110896; BOM_LCSC Assembly: Yes; spicePre: U
U4 = W25Q128JVSIQTR: BOM_Manufacturer: WINBOND; SMT Type: Basic; BOM_Supplier: LCSC; BOM_Manufacturer Part: W25Q128JVSIQTR; BOM_Supplier Part: C97521; BOM_LCSC Assembly: Yes; spicePre: U
U7 = MKDV4GIL-AS: BOM_Manufacturer: MK; Contributor: LCSC; BOM_Supplier: LCSC; BOM_Supplier Part: C379093; BOM_Manufacturer Part: MKDV4GIL-AS; spicePre: U

## Nets that join several sheets
1.2V: 电源单元 (L4.1), 主控单元 (13 pins)
1.8V: 电源单元 (L2.1), 主控单元 (6 pins)
3.3V: 电源单元 (L7.1), 主控单元 (18 pins), 接口单元 (P1.3 P2.4 R20.2), 存储单元 (27 pins)
+5V: 电源单元 (6 pins), 主控单元 (D6.2), 接口单元 (8 pins)
GND: 电源单元 (14 pins), 主控单元 (41 pins), 接口单元 (10 pins), 存储单元 (20 pins)
PA0: 主控单元 (U1.2), 接口单元 (P2.9)
PA1: 主控单元 (U1.3), 接口单元 (P2.12)
PA2: 主控单元 (U1.4), 接口单元 (P2.11)
PA3: 主控单元 (U1.5), 接口单元 (P2.14)
PA4: 主控单元 (U1.6), 接口单元 (P2.13)
PA5: 主控单元 (U1.7), 接口单元 (P2.16)
PA6: 主控单元 (U1.8), 接口单元 (P2.15)
PA7: 主控单元 (U1.14), 接口单元 (P2.18)
PA8: 主控单元 (U1.15), 接口单元 (P2.17)
PA9: 主控单元 (U1.16), 接口单元 (P2.20)
PA10: 主控单元 (U1.17), 接口单元 (P2.19)
PA11: 主控单元 (U1.18), 接口单元 (P2.22)
PA12: 主控单元 (U1.19), 接口单元 (P2.21)
PB0: 主控单元 (U1.29), 接口单元 (P2.32)
PB1: 主控单元 (U1.36), 接口单元 (P1.26)
PB2: 主控单元 (U1.38), 接口单元 (P1.24)
PB3: 主控单元 (U1.37), 接口单元 (P1.23)
PB4: 主控单元 (U1.31), 接口单元 (P3.1)
PB5: 主控单元 (U1.35), 接口单元 (P1.25)
PB6: 主控单元 (U1.30), 接口单元 (P3.2)
PB7: 主控单元 (U1.34), 接口单元 (P1.28)
PB8: 主控单元 (U1.42), 接口单元 (P1.27)
PB13: 主控单元 (U1.93), 接口单元 (P1.10)
PC0: 主控单元 (U1.44), 接口单元 (P1.30)
PC1: 主控单元 (U1.45), 接口单元 (P3.3), 存储单元 (U3.9)
PC2: 主控单元 (U1.46), 接口单元 (P3.4), 存储单元 (R29.2 U3.19)
PC3: 主控单元 (U1.47), 接口单元 (P3.5), 存储单元 (U3.17)
PC4: 主控单元 (U1.48), 接口单元 (P3.6), 存储单元 (U3.16)
PC5: 主控单元 (U1.49), 接口单元 (P3.7), 存储单元 (U3.18)
PC6: 主控单元 (U1.50), 接口单元 (P3.8), 存储单元 (U3.8)
PC7: 主控单元 (U1.51), 接口单元 (P3.9), 存储单元 (R28.1 U3.7)
PC8: 主控单元 (U1.52), 接口单元 (P3.10), 存储单元 (U3.29)
PC9: 主控单元 (U1.53), 接口单元 (P3.11), 存储单元 (U3.30)
PC10: 主控单元 (U1.54), 接口单元 (P3.12), 存储单元 (U3.31)
PC11: 主控单元 (U1.55), 接口单元 (P3.13), 存储单元 (U3.32)
PC12: 主控单元 (U1.56), 接口单元 (P3.14), 存储单元 (U3.41)
PC13: 主控单元 (U1.57), 接口单元 (P3.15), 存储单元 (U3.42)
PC14: 主控单元 (U1.58), 接口单元 (P3.16), 存储单元 (U3.43)
PC15: 主控单元 (U1.59), 接口单元 (P3.17), 存储单元 (U3.44)
PD2: 主控单元 (U1.61), 存储单元 (R30.1 U4.1)
PD3: 主控单元 (U1.62), 存储单元 (R16.2)
PD4: 主控单元 (U1.63), 存储单元 (U4.5)
PD5: 主控单元 (U1.65), 存储单元 (U4.2)
PD6: 主控单元 (U1.66), 存储单元 (R32.1 U4.3)
PD7: 主控单元 (U1.67), 存储单元 (R31.1 U4.7)
PD8: 主控单元 (U1.68), 接口单元 (P1.21)
PD9: 主控单元 (U1.69), 接口单元 (P1.22)
PD10: 主控单元 (U1.70), 接口单元 (P1.19)
PD11: 主控单元 (U1.71), 接口单元 (P1.20)
PD12: 主控单元 (U1.72), 接口单元 (P1.17)
PD13: 主控单元 (U1.73), 接口单元 (P1.18)
PD14: 主控单元 (U1.74), 接口单元 (P1.15)
PD15: 主控单元 (U1.75), 接口单元 (P1.16)
PE10: 主控单元 (U1.115), 接口单元 (P2.8)
PE12: 主控单元 (U1.117), 接口单元 (P2.10)
PF0: 主控单元 (U1.86), 存储单元 (R72.1 TF_CARD1.3 U7.5)
PF1: 主控单元 (U1.87), 存储单元 (R15.1)
PF2: 主控单元 (U1.88), 存储单元 (R71.1 TF_CARD1.7 U7.6)
PF3: 主控单元 (U1.89), 存储单元 (R70.1 TF_CARD1.8 U7.7)
PF4: 主控单元 (U1.90), 存储单元 (R26.1 TF_CARD1.1 U7.1)
PF5: 主控单元 (U1.91), 存储单元 (R25.1 TF_CARD1.2 U7.2)
PF6: 主控单元 (U1.92), 存储单元 (R24.1 TF_CARD1.9)
PF7: 主控单元 (U1.96), 接口单元 (P1.8)
PF8: 主控单元 (U1.97), 接口单元 (P1.7)
PF9: 主控单元 (U1.98), 接口单元 (P1.6)
PF10: 主控单元 (U1.99), 接口单元 (P1.5)
PG0: 主控单元 (R18.1 U1.28), 接口单元 (P2.29)
PG1: 主控单元 (R19.1 U1.27), 接口单元 (P2.30)
PG3: 主控单元 (R61.1 U1.26), 接口单元 (P2.27)
PG5: 主控单元 (R60.1 U1.25), 接口单元 (P2.28)
PG6: 主控单元 (U1.24), 接口单元 (P2.25)
PG7: 主控单元 (U1.23), 接口单元 (P2.26)
PG8: 主控单元 (R62.1 U1.22), 接口单元 (P2.23)
PG9: 主控单元 (R63.1 U1.21), 接口单元 (P2.24)
PG11: 主控单元 (U1.76), 接口单元 (P1.13)
PG12: 主控单元 (U1.77), 接口单元 (P1.14)
PG13: 主控单元 (U1.78), 接口单元 (P1.11)
PG14: 主控单元 (U1.79), 接口单元 (P1.12)
PG15: 主控单元 (U1.80), 接口单元 (P1.9)
USB0_DM: 主控单元 (R12.2 U1.124), 接口单元 (R33.2 R53.2)
USB0_DP: 主控单元 (R13.2 U1.125), 接口单元 (R27.2 R54.2)
USB0_ID: 主控单元 (U1.1), 接口单元 (U9.2)
USB1_DM: 主控单元 (U1.119), 接口单元 (R39.1 R58.2)
USB1_DP: 主控单元 (U1.120), 接口单元 (R23.1 R59.2)